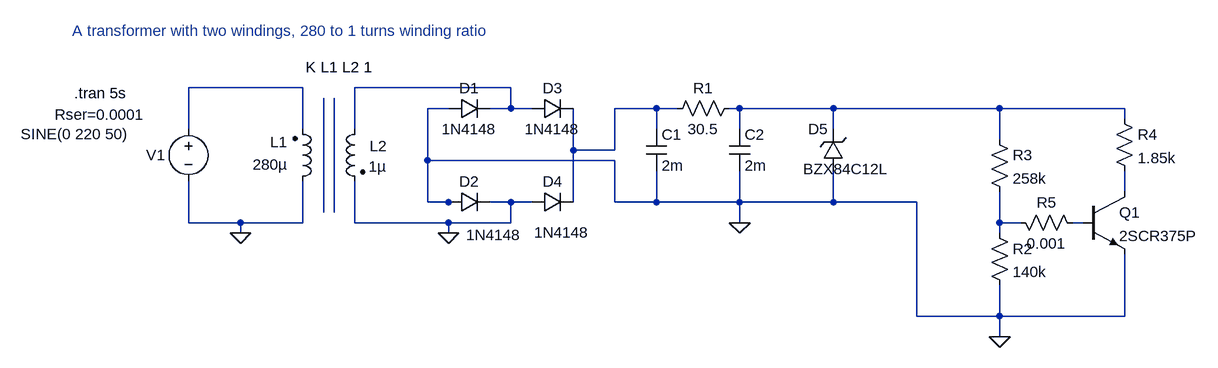
[diagram p0: schematic (DC)PowerSupply.asc]
(DC)PowerSupply.asc, the LTspice schematic file:
Version 4
SHEET 1 1784 680
WIRE 80 128 -96 128
WIRE 400 128 160 128
WIRE 304 160 272 160
WIRE 400 160 400 128
WIRE 400 160 368 160
WIRE 432 160 400 160
WIRE 624 160 560 160
WIRE 656 160 624 160
WIRE 752 160 736 160
WIRE 896 160 752 160
WIRE 1152 160 896 160
WIRE 1344 160 1152 160
WIRE 1344 176 1344 160
WIRE -96 192 -96 128
WIRE 80 192 80 128
WIRE 160 192 160 128
WIRE 624 192 624 160
WIRE 752 192 752 160
WIRE 896 192 896 160
WIRE 1152 208 1152 160
WIRE 496 224 496 160
WIRE 560 224 560 160
WIRE 560 224 496 224
WIRE 272 240 272 160
WIRE 560 240 272 240
WIRE 1344 288 1344 256
WIRE 272 304 272 240
WIRE 304 304 272 304
WIRE 320 304 304 304
WIRE 400 304 368 304
WIRE 432 304 400 304
WIRE 496 304 496 224
WIRE 560 304 560 240
WIRE 624 304 624 256
WIRE 624 304 560 304
WIRE 752 304 752 256
WIRE 752 304 624 304
WIRE 896 304 896 256
WIRE 896 304 752 304
WIRE 1024 304 896 304
WIRE 112 320 112 144
WIRE 128 320 128 144
WIRE -96 336 -96 272
WIRE -16 336 -96 336
WIRE 80 336 80 272
WIRE 80 336 -16 336
WIRE 160 336 160 272
WIRE 304 336 160 336
WIRE 400 336 400 304
WIRE 400 336 304 336
WIRE 752 336 752 304
WIRE 1152 336 1152 288
WIRE 1184 336 1152 336
WIRE 1280 336 1264 336
WIRE -16 352 -16 336
WIRE 304 352 304 336
WIRE 1152 352 1152 336
WIRE 1024 480 1024 304
WIRE 1152 480 1152 432
WIRE 1152 480 1024 480
WIRE 1344 480 1344 384
WIRE 1344 480 1152 480
WIRE 1152 512 1152 480
FLAG 304 352 0
FLAG -16 352 0
FLAG 752 336 0
FLAG 1152 512 0
SYMBOL ind2 64 288 M180
WINDOW 0 -7 76 Right 2
WINDOW 3 -7 42 Right 2
SYMATTR InstName L1
SYMATTR Value 280µ
SYMATTR Type ind
SYMBOL ind2 176 176 M0
WINDOW 0 -7 42 Right 2
WINDOW 3 -5 73 Right 2
SYMATTR InstName L2
SYMATTR Value 1µ
SYMATTR Type ind
SYMBOL voltage -96 176 R0
WINDOW 0 -65 56 Left 2
WINDOW 3 -258 23 Left 2
WINDOW 123 -174 251 Left 2
WINDOW 39 -206 -7 Left 2
SYMATTR InstName V1
SYMATTR Value SINE(0 220 50)
SYMATTR SpiceLine Rser=0.0001
SYMBOL diode 304 176 R270
WINDOW 0 32 32 VTop 2
WINDOW 3 0 32 VBottom 2
SYMATTR InstName D1
SYMATTR Value 1N4148
SYMBOL diode 304 320 R270
WINDOW 0 32 32 VTop 2
WINDOW 3 -19 70 VBottom 2
SYMATTR InstName D2
SYMATTR Value 1N4148
SYMBOL diode 432 176 R270
WINDOW 0 32 32 VTop 2
WINDOW 3 0 32 VBottom 2
SYMATTR InstName D3
SYMATTR Value 1N4148
SYMBOL diode 432 320 R270
WINDOW 0 32 32 VTop 2
WINDOW 3 -15 46 VBottom 2
SYMATTR InstName D4
SYMATTR Value 1N4148
SYMBOL cap 608 192 R0
SYMATTR InstName C1
SYMATTR Value 2m
SYMBOL res 752 144 R90
WINDOW 0 0 56 VBottom 2
WINDOW 3 32 56 VTop 2
SYMATTR InstName R1
SYMATTR Value 30.5
SYMBOL zener 912 256 R180
WINDOW 0 24 64 Left 2
WINDOW 3 -69 3 Left 2
SYMATTR InstName D5
SYMATTR Value BZX84C12L
SYMBOL npn 1280 288 R0
SYMATTR InstName Q1
SYMATTR Value 2SCR375P
SYMBOL res 1328 160 R0
SYMATTR InstName R4
SYMATTR Value 1.85k
SYMBOL cap 736 192 R0
SYMATTR InstName C2
SYMATTR Value 2m
SYMBOL res 1136 336 R0
SYMATTR InstName R2
SYMATTR Value 140k
SYMBOL res 1136 192 R0
SYMATTR InstName R3
SYMATTR Value 258k
SYMBOL res 1168 320 M90
WINDOW 0 0 56 VBottom 2
WINDOW 3 32 56 VTop 2
SYMATTR InstName R5
SYMATTR Value 0.001
TEXT 136 112 Bottom 2 !K L1 L2 1
TEXT -272 136 Left 2 !.tran 5s
TEXT 48 56 Bottom 2 ;A transformer with two windings, 280 to 1 turns winding ratio

The netlist it stands for:
* (DC)PowerSupply.asc
L1 0 N001 280µ
L2 N002 0 1µ
V1 N001 0 SINE(0 220 50) Rser=0.0001
D1 0 N002 1N4148
D2 0 0 1N4148
D3 N002 N003 1N4148
D4 0 N003 1N4148
C1 N003 0 2m
R1 N004 N003 30.5
D5 0 N004 BZX84C12L
Q1 N005 N009 0 0 2SCR375P
R4 N004 N005 1.85k
C2 N004 0 2m
R2 N008 0 140k
R3 N004 N008 258k
R5 N008 N009 0.001
.model D D
.lib standard.dio
.model NPN NPN
.model PNP PNP
.lib standard.bjt
K L1 L2 1
.tran 5s
* A transformer with two windings, 280 to 1 turns winding ratio
.backanno
.end